# Altium schematic sheet Pulse2.SchDoc
size A4
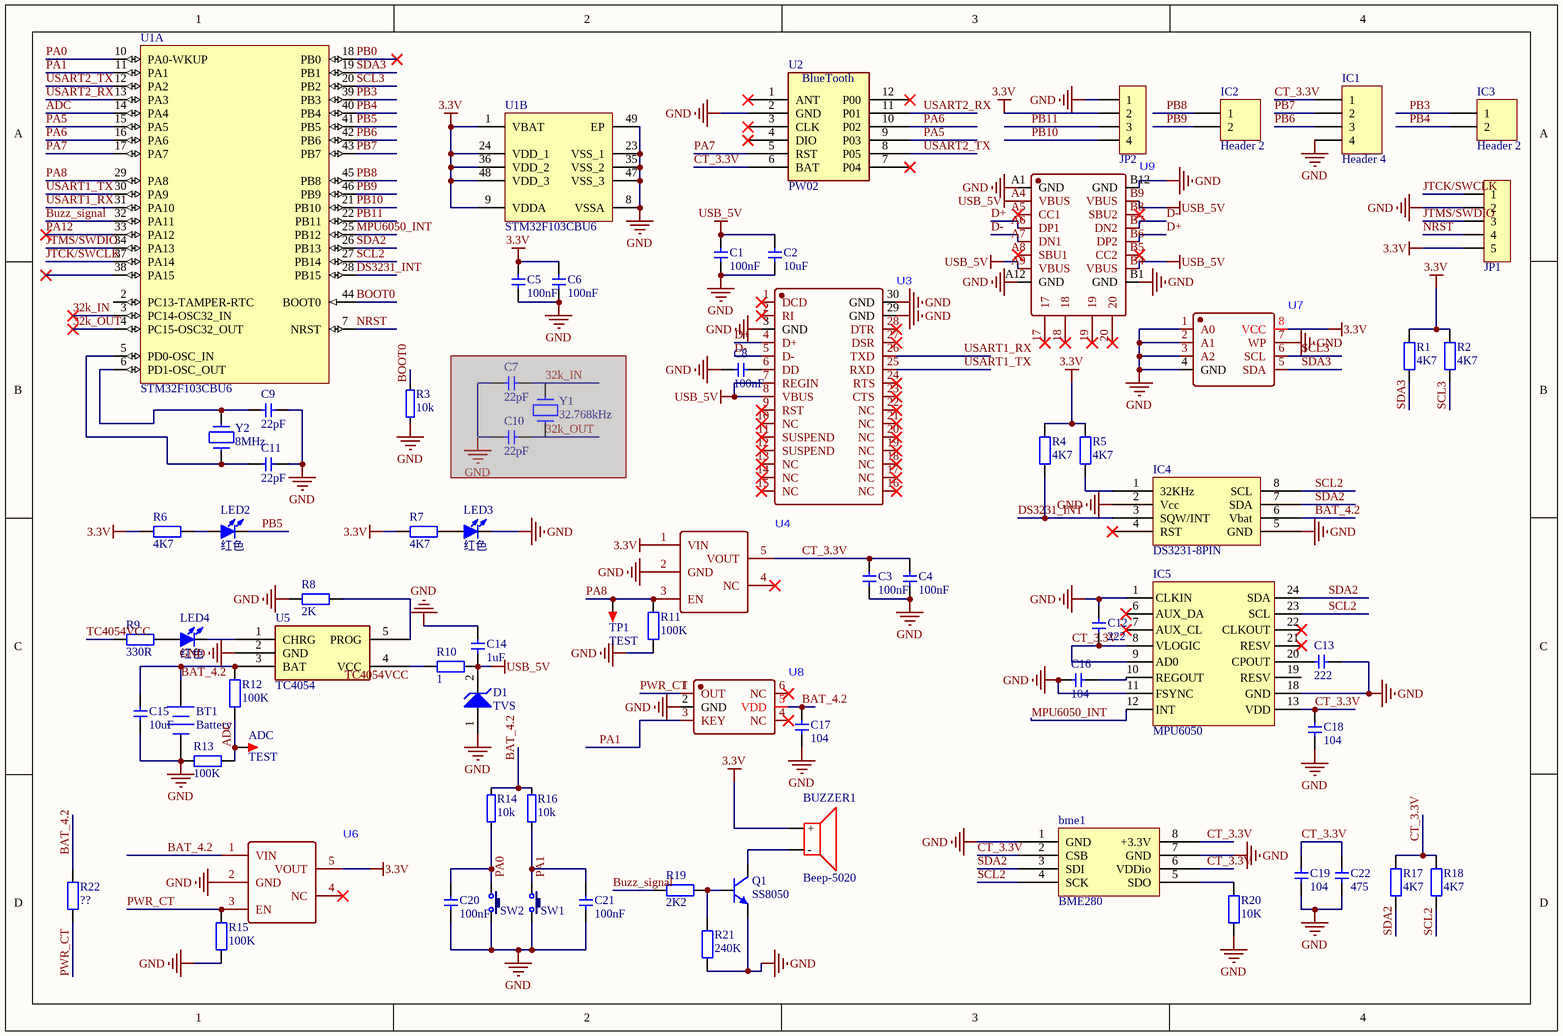
[diagram p0: Pulse2.SchDoc]

## Parts
ADC  TEST  [TEST 0.8]
bme1  BME280  [BME280]
BT1  Battery  [BAT-2]
BUZZER1  Beep-5020  [5020BUZZER]
C1  100nF  [C 0402_L]
C2  10uF  [C 0402_L]
C3  100nF  [C 0402_L]
C4  100nF  [C 0402_L]
C5  100nF  [C 0402_L]
C6  100nF  [C 0402_L]
C7  22pF  [C 0402_L]  (masked out: inside a compile mask, not in the netlist)
C8  100nF  [C 0402_L]
C9  22pF  [C 0402_L]
C10  22pF  [C 0402_L]  (masked out: inside a compile mask, not in the netlist)
C11  22pF  [C 0402_L]
C12  222  [C 0402_L]
C13  222  [C 0402_L]
C14  1uF  [C 0402_L]
C15  10uF  [C 0402_L]
C16  104  [C 0402_L]
C17  104  [C 0402_L]
C18  104  [C 0402_L]
C19  104  [C 0402_L]
C20  100nF  [C 0402_L]
C21  100nF  [C 0402_L]
C22  475  [C 0402_L]
D1  TVS  [LC-SOD-123]
IC1  Header 4  [HDR1X4]
IC2  Header 2  [HDR1X2]
IC3  Header 2  [HDR1X2]
IC4  DS3231-8PIN  [SOP8_N]
IC5  MPU6050  [QFN24 4x4_M]
JP1  HDR-1X5  [MX 1.25-LI-5P]  (value not drawn)
JP2  HDR-1X4  [HDR2.54-M-LI-4P]  (value not drawn)
LED2  红色  [LED 0603R]
LED3  红色  [LED 0603R]
LED4  红色  [LED 0603R]
Q1  SS8050  [SOT23-3N]
R1  4K7  [R 0402_L]
R2  4K7  [R 0402_L]
R3  10k  [R 0402_L]
R4  4K7  [R 0402_L]
R5  4K7  [R 0402_L]
R6  4K7  [R 0402_L]
R7  4K7  [R 0402_L]
R8  2K  [R 0402_L]
R9  330R  [R 0402_L]
R10  1  [R 1206_L]
R11  100K  [R 0402_L]
R12  100K  [R 0402_L]
R13  100K  [R 0402_L]
R14  10k  [R 0402_L]
R15  100K  [R 0402_L]
R16  10k  [R 0402_L]
R17  4K7  [R 0402_L]
R18  4K7  [R 0402_L]
R19  2K2  [R 0402_L]
R20  10K  [R 0402_L]
R21  240K  [R 0402_L]
R22  ??  [R 0402_L]
SW1  3x6x5  [button]  (value not drawn)
SW2  3x6x5  [button]  (value not drawn)
TP1  TEST  [TEST 1]
U1  STM32F103CBU6  [STMF103CBU6]  (parts A,B of 2)
U2  PW02  [bluetooth]
U3  (no value)  [CP2102]
U4  (no value)  [RT9013-33GB]
U5  TC4054  [SOT23-5]
U6  (no value)  [RT9013-33GB]
U7  (no value)  [AT24C256]
U8  (no value)  [EC190708]
U9  (no value)  [TYPE-C CB1.6]
Y1  32.768kHz  [OSC 3215-2P]  (masked out: inside a compile mask, not in the netlist)
Y2  8MHz  [OSC 5032-2P]

## Nets
3.3V: BUZZER1.1(+) C5.1 C6.1 JP1.5 JP2.2 R1.2 R2.2 R4.2 R5.2 R6.1 R7.1 U1.1(VBAT) U1.9(VDDA) U1.24(VDD_1) U1.36(VDD_2) U1.48(VDD_3) U4.1(VIN) U6.5(VOUT) U7.8(VCC)
GND: bme1.1(GND) bme1.7(GND) BT1.2(-) C1.2 C2.2 C3.2 C4.2 C5.2 C6.2 C8.2 C9.1 C11.1 C12.2 C13.2 C14.1 C15.2 C16.2 C17.2 C18.2 C19.2 C20.2 C21.2 C22.2 D1.1(A) IC1.4 IC4.2(Vcc) IC4.5(GND) IC5.1(CLKIN) IC5.11(FSYNC) IC5.18(GND) JP1.2 JP2.1 LED3.2(K) Q1.2(E) R3.2 R8.1 R11.1 R13.1 R15.1 R20.1 R21.1 SW1.2 SW2.2 U1.8(VSSA) U1.23(VSS_1) U1.35(VSS_2) U1.47(VSS_3) U1.49(EP) U2.2(GND) U3.3(GND) U3.29(GND) U3.30(GND) U4.2(GND) U5.2(GND) U6.2(GND) U7.1(A0) U7.2(A1) U7.3(A2) U7.4(GND) U7.7(WP) U8.2(GND) U9.A1(GND) U9.A12(GND) U9.B1(GND) U9.B12(GND)
USB_5V: C1.1 C2.1 C14.2 D1.2(K) R10.2 U3.7(REGIN) U3.8(VBUS) U9.A4(VBUS) U9.A9(VBUS) U9.B4(VBUS) U9.B9(VBUS)
32k_IN: U1.3(PC14-OSC32_IN)
32k_OUT: U1.4(PC15-OSC32_OUT)
ADC: ADC.1 R12.1 R13.2 U1.14(PA4)
BAT_4.2: BT1.1(+) C15.1 C17.1 IC4.6(Vbat) R12.2 R14.1 R16.1 R22.1 U5.3(BAT) U6.1(VIN) U8.5(VDD)
BOOT0: R3.1 U1.44(BOOT0)
Buzz_signal: R19.2 U1.32(PA11)
CT_3.3V: bme1.2(CSB) bme1.6(VDDio) bme1.8(+3.3V) C3.1 C4.1 C12.1 C18.1 C19.1 C22.1 IC1.1 IC5.8(VLOGIC) IC5.9(AD0) IC5.13(VDD) R17.2 R18.2 U2.6(BAT) U4.5(VOUT)
D+: U3.4(D+) U9.A6(DP1) U9.B6(DP2)
D-: U3.5(D-) U9.A7(DN1) U9.B7(DN2)
DS3231_INT: IC4.3(SQW/INT) R4.1 U1.28(PB15)
JTCK/SWCLK: JP1.1 U1.37(PA14)
JTMS/SWDIO: JP1.3 U1.34(PA13)
MPU6050_INT: IC5.12(INT) U1.25(PB12)
NRST: JP1.4 U1.7(NRST)
PA0: C20.1 R14.2 SW2.1 U1.10(PA0-WKUP)
PA1: C21.1 R16.2 SW1.1 U1.11(PA1) U8.3(KEY)
PA5: U1.15(PA5) U2.9(P03)
PA6: U1.16(PA6) U2.10(P02)
PA7: U1.17(PA7) U2.5(RST)
PA8: R11.2 TP1.1 U1.29(PA8) U4.3(EN)
PA12: U1.33(PA12)
PB0: U1.18(PB0)
PB3: IC3.1 U1.39(PB3)
PB4: IC3.2 U1.40(PB4)
PB5: LED2.2(K) U1.41(PB5)
PB6: IC1.3 U1.42(PB6)
PB7: IC1.2 U1.43(PB7)
PB8: IC2.1 U1.45(PB8)
PB9: IC2.2 U1.46(PB9)
PB10: JP2.4 U1.21(PB10)
PB11: JP2.3 U1.22(PB11)
PWR_CT: R15.2 R22.2 U6.3(EN) U8.1(OUT)
SCL2: bme1.4(SCK) IC4.8(SCL) IC5.23(SCL) R18.1 U1.27(PB14)
SCL3: R2.1 U1.20(PB2) U7.6(SCL)
SDA2: bme1.3(SDI) IC4.7(SDA) IC5.24(SDA) R17.1 U1.26(PB13)
SDA3: R1.1 U1.19(PB1) U7.5(SDA)
TC4054VCC: R9.1 R10.1 U5.4(VCC)
USART1_RX: U1.31(PA10) U3.26(TXD)
USART1_TX: U1.30(PA9) U3.25(RXD)
USART2_RX: U1.13(PA3) U2.11(P01)
USART2_TX: U1.12(PA2) U2.8(P05)
Netbme1_5: bme1.5(SDO) R20.2
NetBUZZER1_2: BUZZER1.2(-) Q1.3(C)
NetC8_1: C8.1 U3.6(DD)
NetC9_2: C9.2 U1.6(PD1-OSC_OUT) Y2.1
NetC11_2: C11.2 U1.5(PD0-OSC_IN) Y2.2
NetC13_1: C13.1 IC5.20(CPOUT)
NetC16_1: C16.1 IC5.10(REGOUT)
NetIC4_1: IC4.1(32KHz) R5.1
NetLED2_1: LED2.1(A) R6.2
NetLED3_1: LED3.1(A) R7.2
NetLED4_1: LED4.1(A) R9.2
NetLED4_2: LED4.2(K) U5.1(CHRG)
NetQ1_1: Q1.1(B) R19.1 R21.2
NetR8_2: R8.2 U5.5(PROG)

Not connected (* = marked no-connect by the designer): IC4 4(RST)*; IC5 6(AUX_DA)* 7(AUX_CL)* 19(RESV) 21(RESV)* 22(CLKOUT)*; U1 2(PC13-TAMPER-RTC) 38(PA15)*; U2 1(ANT)* 3(CLK)* 4(DIO)* 7(P04)* 12(P00)*; U3 1(DCD)* 2(RI)* 9(RST)* 10(NC)* 11(SUSPEND)* 12(SUSPEND)* 13(NC)* 14(NC)* 15(NC)* 16(NC)* 17(NC)* 18(NC)* 19(NC)* 20(NC)* 21(NC)* 22(NC)* 23(CTS)* 24(RTS)* 27(DSR)* 28(DTR)*; U4 4(NC)*; U6 4(NC)*; U8 4(NC)* 6(NC)*; U9 17* 18* 19* 20* A5(CC1)* A8(SBU1)* B5(CC2)* B8(SBU2)*

## Library data of the parts
ADC TP1 = TEST: 测试点; 版权归属: 封装库来自淘宝 ID：黄晶宝石; BOM名称: 测试点; 学习资源: https://shop463601444.taobao.com
bme1 = BME280: 气压，湿度，温度传感器
BT1 = Battery: Multicell Battery; Published: 24-Mar-1999; LatestRevisionDate: 17-Jul-2002; LatestRevisionNote: Re-released for DXP Platform.; PackageReference: BAT-2; Publisher: Altium Limited; PackageDescription: Battery; 2 Leads
BUZZER1 = Beep-5020: 贴片蜂鸣器5020最小封装
C1-C22 = C
D1 = D Zener: Zener Diode; Published: 8-Jun-2000; LatestRevisionDate: 17-Jul-2002; LatestRevisionNote: Re-released for DXP Platform.; PackageReference: DIODE-0.7; Publisher: Altium Limited; PackageDescription: Diode, Thru-Hole; 2 Leads; 0.7 in Pin Spacing
IC1 = Header 4: Header, 4-Pin; LatestRevisionDate: 17-Jul-2002; LatestRevisionNote: Re-released for DXP Platform.; Publisher: Altium Limited
IC2 IC3 = Header 2: Header, 2-Pin; LatestRevisionDate: 17-Jul-2002; LatestRevisionNote: Re-released for DXP Platform.; Publisher: Altium Limited
IC5 = MPU6050: 陀螺仪
JP1 = Header 5: 5P接插件; 学习资源: 封装库来自淘宝 ID：黄晶宝石; BOM名称: 5P接插件; 联系售后: https://shop463601444.taobao.com
JP2 = Header 4: 4P接插件; 版权归属: 封装库来自淘宝 ID：黄晶宝石; BOM名称: 4P接插件; 学习资源: https://shop463601444.taobao.com
LED2-LED4 = LED-SMD: 贴片LED; 版权归属: 封装库来自淘宝 ID：黄晶宝石; BOM名称: 贴片LED; 学习资源: https://shop463601444.taobao.com
Q1 = 8050-SMD: 高频放大-NPN型; 版权归属: 源创客; 属性: 40V 1.5A 1W 100MHZ; BOM名称: 高频放大-NPN型; 学习资源: www.ooocke.com
R1 R2 R4-R13 R15 R17-R22 = R: 贴片电阻; 版权归属: 来自淘宝 ID：黄晶宝石; BOM名称: 贴片电阻; 联系售后: https://shop463601444.taobao.com
R3 R14 R16 = R
SW1 SW2 = TSW 3x6: 3x6轻触开关; 免费技术支持，联系售后: 唯一出售店铺网址https://shop463601444.taobao.com; 封装库来自淘宝卖家 ID：黄晶宝石: 其他店铺购入均为盗版假冒封装库，请立即申请退款，本店3~10元现金奖励; BOM名称: 3x6轻触开关
U1 = STM32F103CBU6: ARM Cortex-M3 32-bit MCU, 128 KB Flash, 20 KB Internal RAM, 37 I/Os, 48-pin UFQFPN, -40 to 85 degC, Tray; A/D Converter: 2x12-bit (10 Channel); FLASH Size (Prog) (kB): 128; I/Os (High Current): 37; Internal RAM Size (kB): 20; Operating Frequency(F) (Processor speed) (MHz): 72; Supply Voltage(Vcc) min (V): 2; DatasheetVersion: Rev. 16; PackageVersion: Rev. 1, 04/2013; PackageReference: UFQFPN48; PackageDescription: 48-Pin Ultra Thin Fine Pitch Quad Flat No-Lead, 7 x 7 x 0.6 mm Body, 0.5 mm Pitch, Exposed Pad; Supplier 1: Digi-Key; Supplier Part Number 1: STM32F103CBU6-ND; Supplier 2: Farnell; Supplier Part Number 2: 2060891; Supplier 3: Newark; Supplier Part Number 3: 65T3772; Supplier 4: Newark; Supplier Part Number 4: 73T2300; Supplier 5: Mouser; Supplier Part Number 5: 511-STM32F103CBU6; Core: ARM Cortex-M3; Packing: Tray; Mounting Technology: Surface Mount; PartNumber: STM32F103CBU6; ComponentLink1Description: Manufacturer URL; ComponentLink1URL: http://www.st.com/web/en/home.html; ComponentLink2Description: Datasheet; ComponentLink2URL: http://www.st.com/st-web-ui/static/active/en/resource/technical/document/datasheet/CD00161566.pdf; ComponentLink3Description: Package Specification; ComponentLink3URL: http://www.st.com/st-web-ui/static/active/en/resource/technical/document/data_brief/DM00071938.pdf
U2 = PW02: BlueTooth
U3 = CP2102-GMR-YJLTY
U4 U6 = RT9013-33GB
U7 = AT24C256C-SSHL-T
U8 = EC190708
U9 = USB-TYPE_C16P沉
Y1 Y2 = CRYSTAL